# Altium schematic sheet Public_CPU_USB.SchDoc
size D
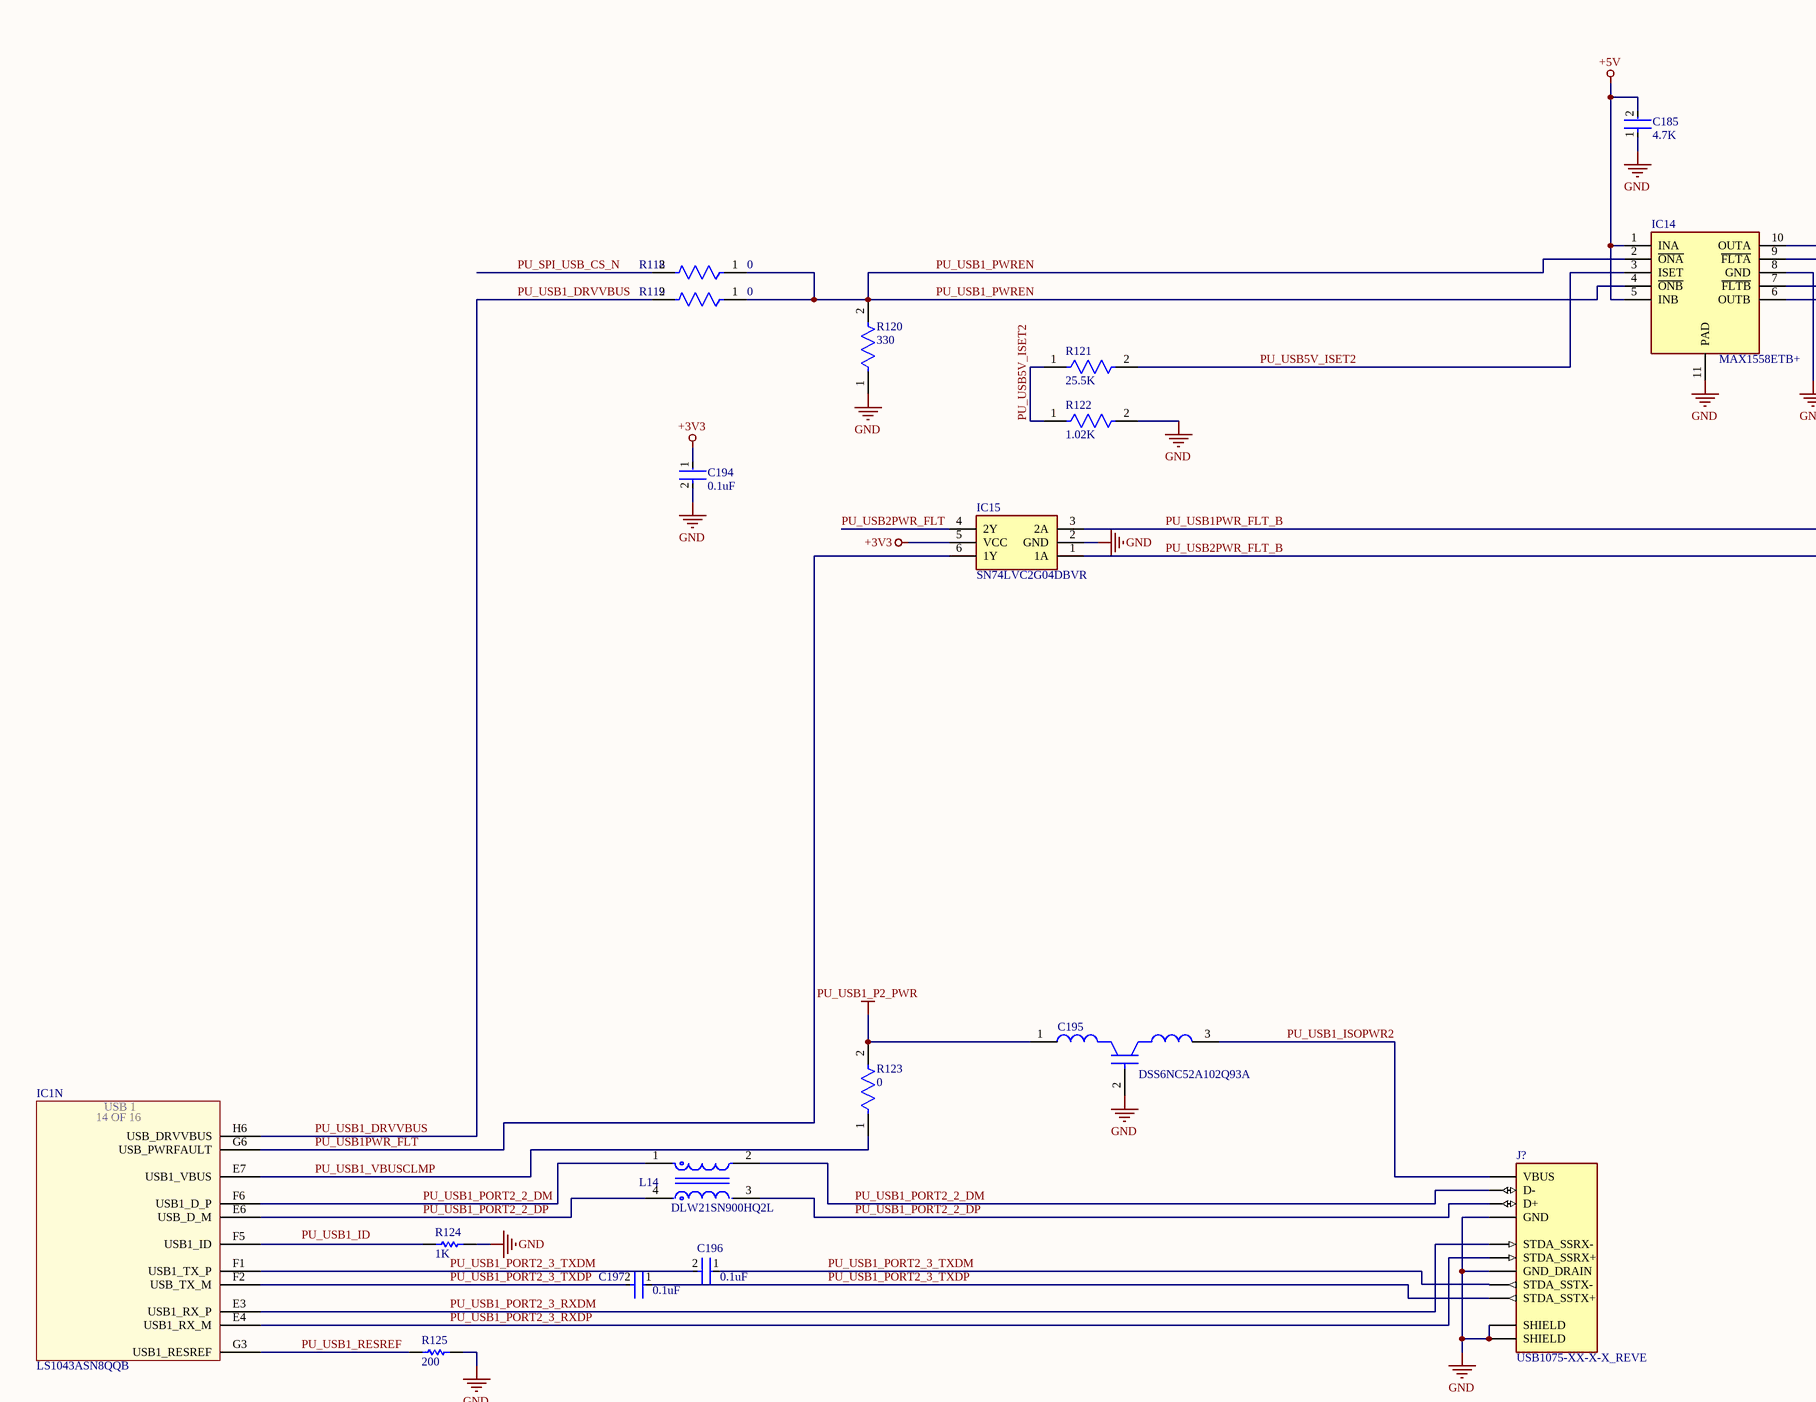
[diagram p0: Public_CPU_USB.SchDoc, top left]
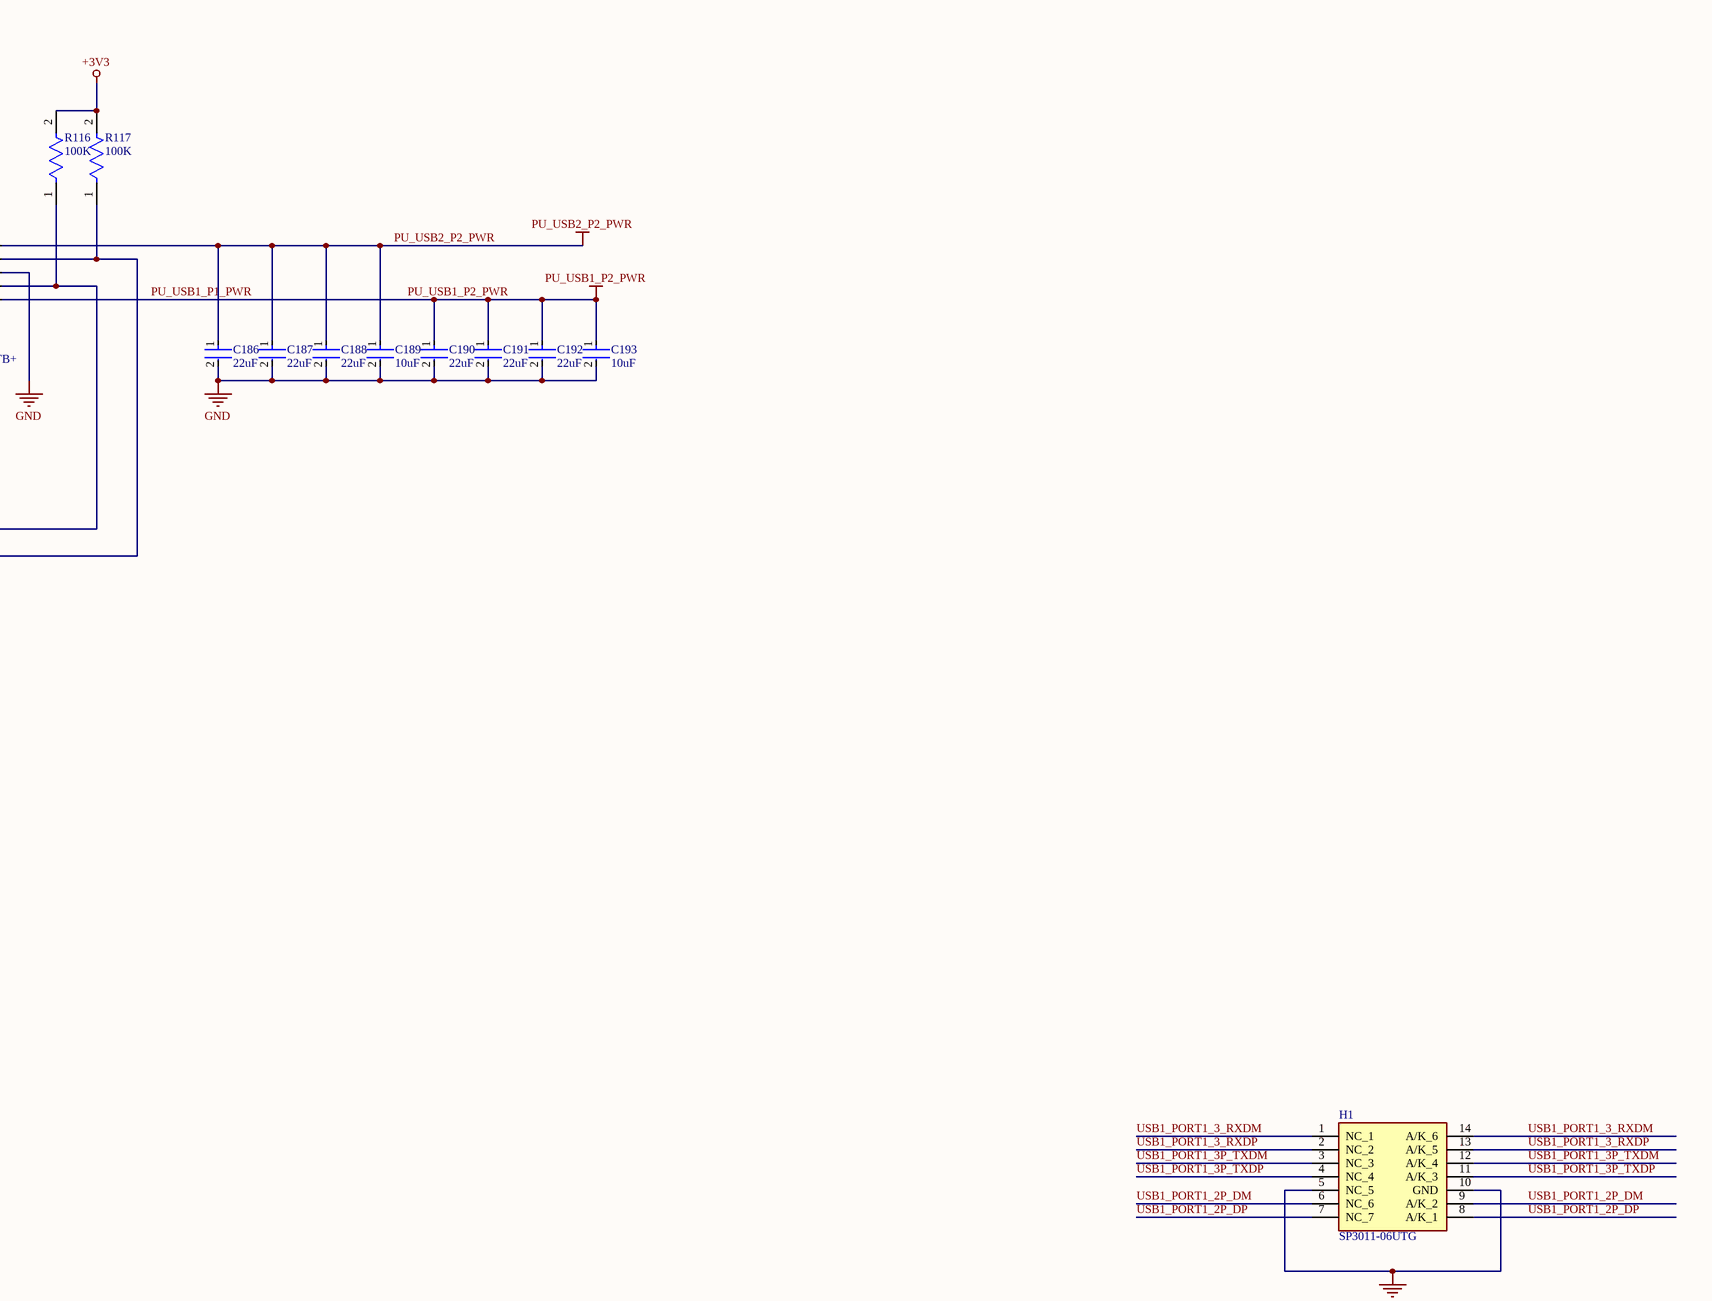
[diagram p1: Public_CPU_USB.SchDoc, top right]
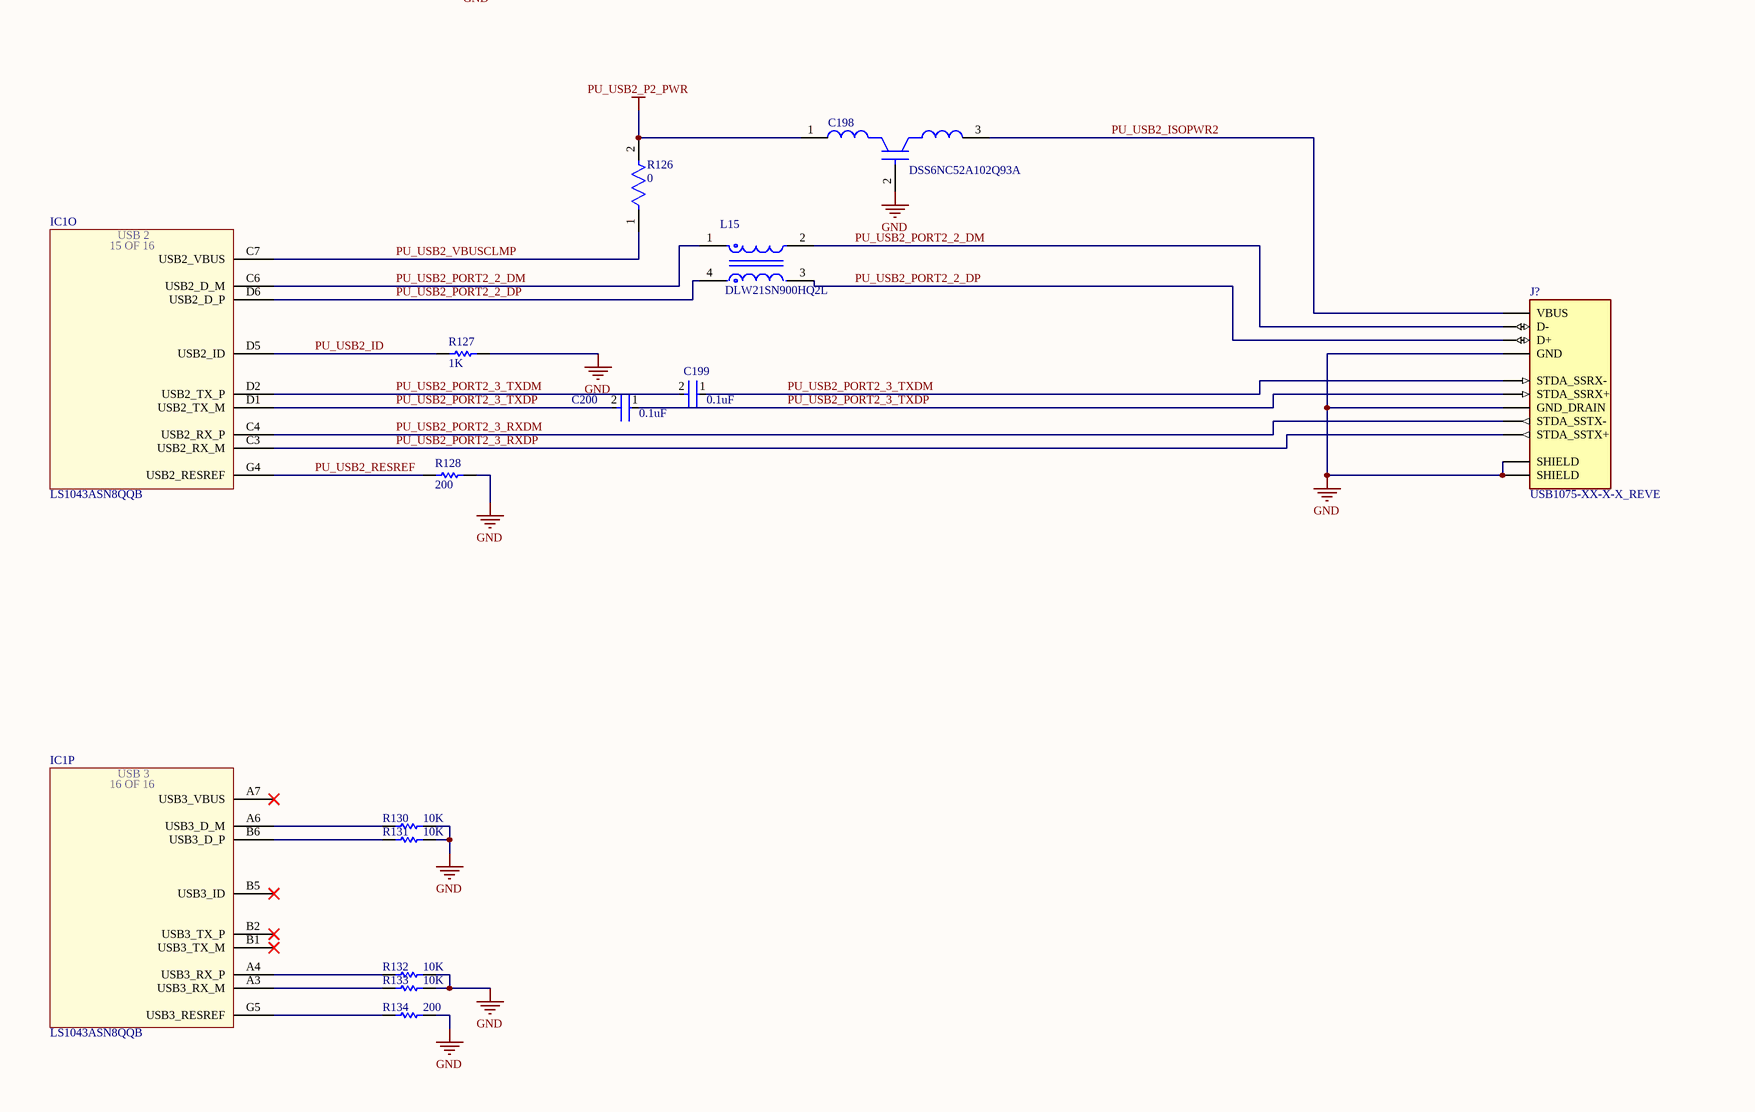
[diagram p2: Public_CPU_USB.SchDoc, bottom left]
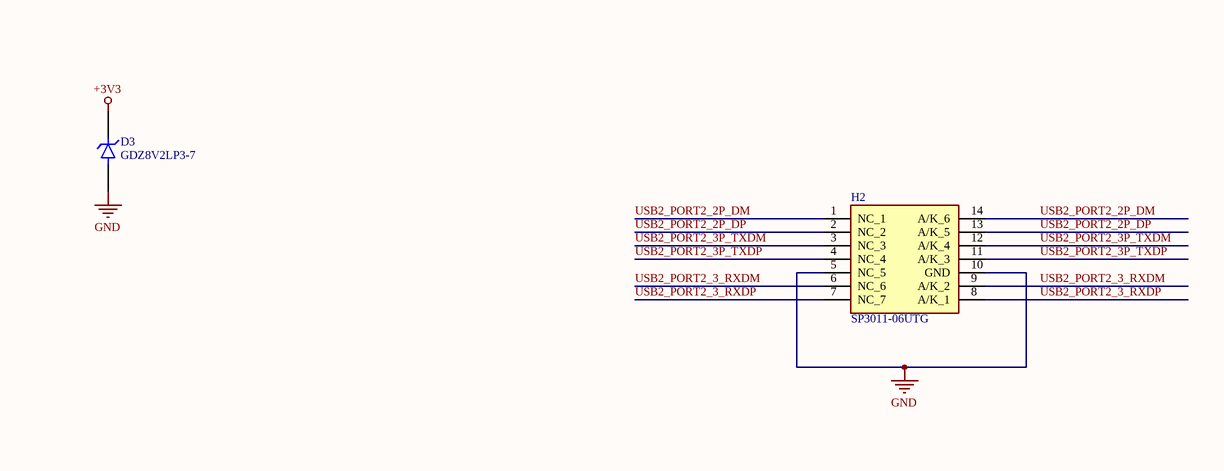
[diagram p3: Public_CPU_USB.SchDoc, bottom right]

## Parts
(Parts that share a designator on the sheet are numbered #1, #2 ... from top to bottom, then left to right.)
C185  4.7K  [FP-GRM155-0_1-IPC_B]
C186  22uF  [FP-GRM21B-0_15-MFG]
C187  22uF  [FP-GRM21B-0_15-MFG]
C188  22uF  [FP-GRM21B-0_15-MFG]
C189  10uF  [FP-C0805C-DG-MFG]
C190  22uF  [FP-GRM21B-0_15-MFG]
C191  22uF  [FP-GRM21B-0_15-MFG]
C192  22uF  [FP-GRM21B-0_15-MFG]
C193  10uF  [FP-C0805C-DG-MFG]
C194  0.1uF  [FP-GRM15-MFG]
C195  DSS6NC52A102Q93A  [FP-DSS6N_Q-MFG]
C196  0.1uF  [FP-GRM15-MFG]
C197  0.1uF  [FP-GRM15-MFG]
C198  DSS6NC52A102Q93A  [FP-DSS6N_Q-MFG]
C199  0.1uF  [FP-GRM15-MFG]
C200  0.1uF  [FP-GRM15-MFG]
D3  GDZ8V2LP3-7  [DIODFN2_62X32X35L19X24N]
H1  SP3011-06UTG  [SON50P135X350X55-14N]
H2  SP3011-06UTG  [SON50P135X350X55-14N]
IC1  LS1043ASN8QQB  [BGA780C80P28X28_2300X2300X261]  (parts N,O,P of 16)
IC14  MAX1558ETB+  [SON50P300X300X80-11N]
IC15  SN74LVC2G04DBVR  [SOT95P280X145-6N]
J?#1  USB1075-XX-X-X_REVE  [GCT_USB1075-XX-X-X_REVE]
J?#2  USB1075-XX-X-X_REVE  [GCT_USB1075-XX-X-X_REVE]
L14  DLW21SN900HQ2L  [FP-DLW21S-MFG]
L15  DLW21SN900HQ2L  [FP-DLW21S-MFG]
R116  100K  [FP-ERJ2RK-IPC_C]
R117  100K  [FP-ERJ2RK-IPC_C]
R118  0  [FP-CRCW0402-e3-IPC_C]
R119  0  [FP-CRCW0402-e3-IPC_C]
R120  330  [FP-CRCW0402-e3-MFG]
R121  25.5K  [FP-CRCW0402-e3-IPC_A]
R122  1.02K  [FP-CRCW0402-e3-IPC_C]
R123  0  [FP-CRCW0402-e3-IPC_C]
R124  1K  [RESC1005X40X25NL05T05]
R125  200  [RESC1005X40X25ML05T05]
R126  0  [FP-CRCW0402-e3-IPC_C]
R127  1K  [RESC1005X40X25NL05T05]
R128  200  [RESC1005X40X25ML05T05]
R130  10K  [RESC1005X40X25LL05T10]
R131  10K  [RESC1005X40X25LL05T10]
R132  10K  [RESC1005X40X25LL05T10]
R133  10K  [RESC1005X40X25LL05T10]
R134  200  [RESC1005X40X25ML05T05]

## Nets
+3V3: C194.1 D3.C IC15.5(VCC) R116.2 R117.2
+5V: C185.2 IC14.1(INA) IC14.5(INB)
GND: C185.1 C186.2 C187.2 C188.2 C189.2 C190.2 C191.2 C192.2 C193.2 C194.2 C195.2(GND) C198.2(GND) D3.A H1.5(NC_5) H1.10(GND) H2.5(NC_5) H2.10(GND) IC14.8(GND) IC14.11(PAD) IC15.2(GND) J?#1.4(GND) J?#1.7(GND_DRAIN) J?#1.10(SHIELD) J?#1.11(SHIELD) J?#2.4(GND) J?#2.7(GND_DRAIN) J?#2.10(SHIELD) J?#2.11(SHIELD) R120.1 R122.2 R124.2 R125.2 R127.2 R128.2 R130.2 R131.2 R132.2 R133.2 R134.2
PU_USB1_P1_PWR: C190.1 C191.1 C192.1 C193.1 C195.1 IC14.6(OUTB) R123.2  [also labelled PU_USB1_P2_PWR]
PU_USB2_P2_PWR: C186.1 C187.1 C188.1 C189.1 C198.1 IC14.10(OUTA) R126.2
PU_SPI_USB_CS_N: R118.2
PU_USB1_DRVVBUS: IC1.H6(USB_DRVVBUS) R119.2
PU_USB1_ISOPWR2: C195.3 J?#1.1(VBUS)
PU_USB1_PORT2_2_DM: IC1.F6(USB1_D_P) J?#1.2(D-) L14.1 L14.2
PU_USB1_PORT2_2_DP: IC1.E6(USB_D_M) J?#1.3(D+) L14.3 L14.4
PU_USB1_PORT2_3_RXDM: IC1.E3(USB1_RX_P) J?#1.5(STDA_SSRX-)
PU_USB1_PORT2_3_RXDP: IC1.E4(USB1_RX_M) J?#1.6(STDA_SSRX+)
PU_USB1_PORT2_3_TXDM: C196.1 C196.2 IC1.F1(USB1_TX_P) J?#1.8(STDA_SSTX-)
PU_USB1_PORT2_3_TXDP: C197.1 C197.2 IC1.F2(USB_TX_M) J?#1.9(STDA_SSTX+)
PU_USB1_PWREN: IC14.2(~{ONA}) IC14.4(~{ONB}) R118.1 R119.1 R120.2
PU_USB1_RESREF: IC1.G3(USB1_RESREF) R125.1
PU_USB1_VBUSCLMP: IC1.E7(USB1_VBUS) R123.1
PU_USB1PWR_FLT: IC1.G6(USB_PWRFAULT) IC15.6(1Y)
PU_USB1PWR_FLT_B: IC14.7(~{FLTB}) IC15.3(2A) R116.1
PU_USB2_ID: IC1.D5(USB2_ID) R127.1
PU_USB2_ISOPWR2: C198.3 J?#2.1(VBUS)
PU_USB2_PORT2_2_DM: IC1.C6(USB2_D_M) J?#2.2(D-) L15.1 L15.2
PU_USB2_PORT2_2_DP: IC1.D6(USB2_D_P) J?#2.3(D+) L15.3 L15.4
PU_USB2_PORT2_3_RXDM: IC1.C4(USB2_RX_P) J?#2.8(STDA_SSTX-)
PU_USB2_PORT2_3_RXDP: IC1.C3(USB2_RX_M) J?#2.9(STDA_SSTX+)
PU_USB2_PORT2_3_TXDM: C199.1 C199.2 IC1.D2(USB2_TX_P) J?#2.5(STDA_SSRX-)
PU_USB2_PORT2_3_TXDP: C200.1 C200.2 IC1.D1(USB2_TX_M) J?#2.6(STDA_SSRX+)
PU_USB2_RESREF: IC1.G4(USB2_RESREF) R128.1
PU_USB2_VBUSCLMP: IC1.C7(USB2_VBUS) R126.1
PU_USB2PWR_FLT: IC15.4(2Y)
PU_USB2PWR_FLT_B: IC14.9(~{FLTA}) IC15.1(1A) R117.1
PU_USB5V_ISET2: IC14.3(ISET) R121.1 R121.2 R122.1
USB1_PORT1_2P_DM: H1.6(NC_6) H1.9(A/K_2)
USB1_PORT1_2P_DP: H1.7(NC_7) H1.8(A/K_1)
USB1_PORT1_3_RXDM: H1.1(NC_1) H1.14(A/K_6)
USB1_PORT1_3_RXDP: H1.2(NC_2) H1.13(A/K_5)
USB1_PORT1_3P_TXDM: H1.3(NC_3) H1.12(A/K_4)
USB1_PORT1_3P_TXDP: H1.4(NC_4) H1.11(A/K_3)
USB2_PORT2_2P_DM: H2.1(NC_1) H2.14(A/K_6)
USB2_PORT2_2P_DP: H2.2(NC_2) H2.13(A/K_5)
USB2_PORT2_3_RXDM: H2.6(NC_6) H2.9(A/K_2)
USB2_PORT2_3_RXDP: H2.7(NC_7) H2.8(A/K_1)
USB2_PORT2_3P_TXDM: H2.3(NC_3) H2.12(A/K_4)
USB2_PORT2_3P_TXDP: H2.4(NC_4) H2.11(A/K_3)
NetIC1_A3: IC1.A3(USB3_RX_M) R133.1
NetIC1_A4: IC1.A4(USB3_RX_P) R132.1
NetIC1_A6: IC1.A6(USB3_D_M) R130.1
NetIC1_B6: IC1.B6(USB3_D_P) R131.1
NetIC1_F5: IC1.F5(USB1_ID) R124.1
NetIC1_G5: IC1.G5(USB3_RESREF) R134.1

Not connected (* = marked no-connect by the designer): IC1 A7(USB3_VBUS)* B1(USB3_TX_M)* B2(USB3_TX_P)* B5(USB3_ID)*

## Notes on the sheet
- Labels drawn without touching a wire or pin: PU_USB1_ID
- Title
- Size:
- Date:
- File:
- D
- Number:
- Time:
- Revision:
- Sheet
- of
- (in symbol LS1043ASN8QQB, part N) USB 1; 14 OF 16
- (in symbol LS1043ASN8QQB, part O) USB 2; 15 OF 16
- (in symbol LS1043ASN8QQB, part P) USB 3; 16 OF 16

## Library data of the parts
C185 = CMP-2008-04549-2: Chip Multilayer Ceramic Capacitors for General Purpose, 0402, 4.7uF, X5R, 15%, 20%, 6.3V; Height: 0.5mm; Weight: 0.000212oz; Length: 1mm; Case Code (Metric): 1005; Packaging: Tape and Reel; Termination: SMD/SMT; Dielectric: X5R; Depth: 0.5mm; Case Code (Imperial): 0402; Min Operating Temperature: -55°C; Case/Package: 0402; Voltage: 6.3V; Width: 0.02inch; Capacitance: 4.7uF; Lead Free: Lead Free; Thickness: 0.022inch; Contact Plating: Tin; REACH SVHC: No SVHC; Package Quantity: 10000; Tolerance: 20%; Voltage Rating (DC): 6.3V; Voltage Rating: 6.3V; Mount: Surface Mount; Max Operating Temperature: 85°C
C186-C188 C190-C192 = CMP-2007-03385-2: Chip Multilayer Ceramic Capacitors for General Purpose, 0805, 22uF, X5R, 15%, 20%, 6.3V; Material: Ceramic; Max Operating Temperature: 85°C; Voltage: 6.3V; Min Operating Temperature: -55°C; Case/Package: 0805; Thickness: 0.053inch; Dielectric: X5R; Packaging: Tape and Reel; Depth: 1.25mm; Termination: SMD/SMT; Voltage Rating (DC): 6.3V; Radiation Hardening: No; Tolerance: 20%; Mount: Surface Mount; Lead Free: Lead Free; Package Quantity: 1; REACH SVHC: No SVHC; Voltage Rating: 6.3V; Capacitance: 22uF; Length: 2mm; Case Code (Imperial): 0805; Case Code (Metric): 2012; Width: 0.049inch; Height: 1.25mm
C189 C193 = CMP-2007-03243-2: CAP CER 10UF 10V X5R 0805; Manufacturer Part Number: C0805C106K8PACTU; Manufacturer: Kemet; 3DS Part Number: 220-00001; Tolerance: 10%; Temperature Coefficient: 15%; Material: Ceramic; Device Class L2: Capacitors; Device Class L1: Passive Components; ComponentLink2URL: https://content.kemet.com/datasheets/KEM_C1006_X5R_SMD.pdf; Height: 1.4mm; Lead Free: Yes; Digikey Description: CAP CER 10UF 10V X5R 0805; Octopart: https://octopart.com/c0805c106k8pactu-kemet-98697; Capacitance: 10uF; Value: 10uF; Temperature Range Low: -55°C; Temperature: -55°C to +85°C; Automotive: No; Mouser Description: CAP CER 10UF 10V X5R 0805; Ipc Land Pattern Name: CAPC200125X125; Temperature Range High: +85°C; Voltage: 10V; RoHS: TRUE; Device Class L3: Ceramic Capacitors; ComponentLink2Description: Datasheet; Voltage Rating: 10V; Package: C0805C-DG; Temperature Characteristic: X5R; Category: Cap
C194 C196 C197 C199 C200 = CMP-2100-03641-2: CAP CER 0.1UF 16V X7R 0402; Manufacturer Part Number: GRM155R71C104KA88D; Manufacturer: Murata; Standoff Height: 0mm; Tolerance: 10%; Voltage Rating: 16Vdc; Material: Ceramic; Capacitance: 0.10μF; Value: 0.10μF; RoHS: TRUE; Temperature Characteristic: X7R; Octopart: https://octopart.com/grm155r71c104ka88d-murata-196880; Digikey Description: CAP CER 0.1UF 16V X7R 0402; Device Class L3: Ceramic Capacitors; Height: 0.55mm; ComponentLink2Description: Datasheet; Temperature Range Low: -55°C; Ipc Land Pattern Name: CAPC10050X219; ComponentLink2URL: https://search.murata.co.jp/Ceramy/image/img/A01X/G101/ENG/GRM155R71H471KA01-01A.pdf; Device Class L1: Passive Components; Lead Free: yes; Category: Cap; Package: GRM15; Temperature: -55°C to +125°C; Device Class L2: Capacitors; Temperature Range High: +125°C; Mouser Description: 0402 0.1 uF 16V ±10 % Tolerance X7R SMT Multilayer Ceramic Capacitor
C195 C198 = CMP-06053-000338-1: Leaded 3 Terminal Capacitors 1000pF ±20% 100Vdc 6A; Capacitance: 1nF; Voltage Rating (DC): 100V; Ripple Current: 7A; Lead Free: Lead Free; Length: 8mm; Mount: Through Hole; Current Rating: 6A; Min Operating Temperature: -25°C; Width: 2.54mm; Termination: Radial; Max DC Current: 6A; Height: 10mm; Tolerance: 20%; Max Voltage Rating (DC): 100V; Package Quantity: 2000; Max Operating Temperature: 85°C; Radiation Hardening: No; Depth: 2.54mm; Packaging: Tape and Reel; Case/Package: Radial; Max Current Rating: 6A
D3 = GDZ8V2LP3-7: Diode Zener Single 8.2V 5% 250mW Automotive 2-Pin X3-DFN T/R; MF: {'manufacturer': u'Diodes Inc.'}; MP: GDZ8V2LP3-7; Value: *; Availability: Unavailable; Package: None; Price: None
H1 H2 = SP3011-06UTG: Hardware; Manufacturer_Name: LITTELFUSE; Datasheet Link: https://datasheet.datasheetarchive.com/originals/dk/DKDS-14/271280.pdf; Height: 0.55mm; Manufacturer_Part_Number: SP3011-06UTG; Mouser Part Number: 576-SP3011-06UTG; Mouser Price/Stock: https://www.mouser.co.uk/ProductDetail/Littelfuse/SP3011-06UTG?qs=K%252BkT2xeNSS3A727KwWw2sg%3D%3D; Arrow Part Number: SP3011-06UTG; Arrow Price/Stock: https://www.arrow.com/en/products/sp3011-06utg/littelfuse
IC1 = LS1043ASN8QQB: Integrated Circuit; Manufacturer_Name: NXP; Datasheet Link: http://www.nxp.com/secured/assets/documents/en/data-sheet/LS1088A.pdf; Height: 2.61mm; Manufacturer_Part_Number: LS1043ASN8QQB; Mouser Part Number: 771-LS1043ASN8QQB; Mouser Price/Stock: https://www.mouser.co.uk/ProductDetail/NXP-Semiconductors/LS1043ASN8QQB/?qs=AQlKX63v8RsTATOTx7X0Jg%3D%3D
IC14 = MAX1558ETB+: Integrated Circuit; Manufacturer_Name: Maxim Integrated; Datasheet Link: https://datasheets.maximintegrated.com/en/ds/MAX1558-MAX1558H.pdf; Height: 0.8mm; Manufacturer_Part_Number: MAX1558ETB+
IC15 = SN74LVC2G04DBVR: Integrated Circuit; Manufacturer_Name: Texas Instruments; Datasheet Link: http://www.ti.com/lit/gpn/sn74lvc2g04; Height: 1.45mm; Manufacturer_Part_Number: SN74LVC2G04DBVR; Mouser Part Number: 595-SN74LVC2G04DBVR; Mouser Price/Stock: https://www.mouser.co.uk/ProductDetail/Texas-Instruments/SN74LVC2G04DBVR?qs=HE9hdJajmeqXJJ9RII89dg%3D%3D; Arrow Part Number: SN74LVC2G04DBVR; Arrow Price/Stock: https://www.arrow.com/en/products/sn74lvc2g04dbvr/texas-instruments
J?#1 J?#2 = USB1075-XX-X-X_REVE: USB 3.0 Receptacle. Type A, Through Hole, Horizontal, 9 Pin, Top Mount, with Kinked Shelll Stakes; MF: {'manufacturer': u'Global Connector Technology'}; Availability: Unavailable; MP: USB1075-XX-X-X_REVE; Value: *; Package: None; Price: None
L14 L15 = CMP-2000-06163-2: Common Mode Choke, 0805, 90Ω @ 100MHz, 0.41Ω, 25%, 280mA; Impedance: 90R; Shielding: Unshielded; DC Resistance (DCR): 410mR; Number of Lines: 2; RoHS Compliant: Yes; Series: EMIFIL®, DLW21S; Weight: 0.000388oz; Current Rating: 280mA; Case Code (Imperial): 0805; Termination: SMD/SMT; Lead Free: Lead Free; Width: 0.047inch; Height: 0.055inch; Package Quantity: 1; Radiation Hardening: No; Depth: 1.4mm; Packaging: Tape and Reel; Current: 280mA; REACH SVHC: No SVHC; Test Frequency: 100MHz; DC Current: 280mA; Max Operating Temperature: 85°C; Case/Package: 0805; Min Operating Temperature: -40°C; Max DC Current: 280mA; Tolerance: 25%; Resistor Type: Wirewound; Length: 2mm; Mount: Surface Mount; Military Standard: Not
R116 R117 = CMP-2002-00608-4: RES SMD 100K OHM 1% 1/10W 0402; Resistance: 100kR; Voltage Rating (DC): 50V; Power Rating: 100mW; Temperature Coefficient: 100ppm/°C; Case/Package: 0402; Length: 1mm; Package Quantity: 1; Radiation Hardening: No; Case Code (Metric): 1005; Contact Plating: Tin; Mount: Surface Mount; Depth: 0.5mm; Max Operating Temperature: 155°C; Lead Free: Lead Free; Width: 0.5mm; Composition: Thick Film; Case Code (Imperial): 0402; Tolerance: 1%; Termination: SMD/SMT; Number of Pins: 2; Height: 0.35mm; Voltage Rating: 50V; Military Standard: Not; REACH SVHC: No SVHC; Packaging: Tape and Reel; Min Operating Temperature: -55°C; Max Power Dissipation: 100mW; Features: Automotive AEC-Q200; Number of Terminations: 2
R118 R119 R123 R126 = CMP-2002-08122-2: RES Thick Film, 0Ω, 0.063W, 0402; Tolerance: 5%; Max Power Dissipation: 63mW; Voltage Rating: 50V; Temperature Coefficient: 100ppm/°C; Resistance: 0mR; Contact Plating: Tin; Height: 0.35mm; Radiation Hardening: No; Features: Automotive AEC-Q200; Composition: Thick Film; Width: 0.5mm; Weight: 2.3E-05oz; Termination: SMD/SMT; Packaging: Tape and Reel; Mount: Surface Mount; Case Code (Metric): 1005; Military Standard: Not; Min Operating Temperature: -55°C; Number of Terminations: 2; Package Quantity: 1; Case Code (Imperial): 0402; Depth: 0.5mm; Max Operating Temperature: 155°C; Case/Package: 0402; Power Rating: 63mW; Lead Free: Lead Free; Voltage Rating (DC): 50V; Length: 1mm
R120 = CMP-2002-08523-2: RES Thick Film, 330Ω, 1%, 0.063W, 100ppm/°C, 0402; Max Power Dissipation: 63mW; Voltage Rating (DC): 50V; Resistance: 330R; Case/Package: 0402; Packaging: Tape and Reel; Width: 0.5mm; Case Code (Metric): 1005; Radiation Hardening: No; Military Standard: Not; Contact Plating: Tin; Temperature Coefficient: 100ppm/°C; Lead Free: Lead Free; Power Rating: 63mW; Voltage Rating: 50V; Tolerance: 1%; Features: Automotive AEC-Q200; Case Code (Imperial): 0402; Composition: Thick Film; Weight: 2.3E-05oz; Package Quantity: 10; Min Operating Temperature: -55°C; Height: 0.35mm; Length: 1mm; Termination: SMD/SMT; Number of Terminations: 2; Depth: 0.5mm; Max Operating Temperature: 155°C
R121 = CMP-2002-08416-2: RES Thick Film, 25.5kΩ, 1%, 0.063W, 100ppm/°C, 0402; Power Rating: 63mW; Voltage Rating: 50V; Resistance: 25.5kR; Number of Terminations: 2; Length: 1mm; Height: 0.35mm; Termination: SMD/SMT; Radiation Hardening: No; Min Operating Temperature: -55°C; Lead Free: Lead Free; Number of Pins: 2; Mount: Surface Mount; Temperature Coefficient: 100ppm/°C; Weight: 2.3E-05oz; Composition: Thick Film; Depth: 0.5mm; Tolerance: 1%; Width: 0.5mm; Contact Plating: Tin; Features: Automotive AEC-Q200; Max Operating Temperature: 155°C; Case Code (Metric): 1005; Military Standard: Not; Packaging: Tape and Reel; Voltage Rating (DC): 50V; Package Quantity: 10; Case/Package: 0402; Max Power Dissipation: 63mW; Case Code (Imperial): 0402
R122 = CMP-2002-08279-2: RES Thick Film, 1.02kΩ, 1%, 0.063W, 100ppm/°C, 0402; Resistance: 1.02kR; Voltage Rating: 50V; Max Power Dissipation: 63mW; Features: Automotive AEC-Q200; Composition: Thick Film; Termination: SMD/SMT; Number of Terminations: 2; Contact Plating: Tin; Case Code (Imperial): 0402; Width: 0.02inch; Weight: 2.3E-05oz; Case Code (Metric): 1005; Lead Free: Lead Free; Length: 1mm; Packaging: Tape and Reel; Radiation Hardening: No; Case/Package: 0402; Number of Pins: 2; Voltage Rating (DC): 50V; Min Operating Temperature: -55°C; Tolerance: 1%; Package Quantity: 10; Height: 0.016inch; Max Operating Temperature: 155°C; Temperature Coefficient: 100ppm/°C; Depth: 0.5mm; Military Standard: Not; Power Rating: 63mW
R124 R127 = CMP-2002-00432-1: Manufacturer: Panasonic; Part Number: ERJ-2GEJ102X
R125 R128 R134 = CMP-2002-08353-1: Part Number: CRCW0402200RJNED; Manufacturer: Vishay Dale
R130-R133 = CMP-2002-07353-1: Part Number: RC0402FR-0710KL; Manufacturer: Yageo / Phycomp